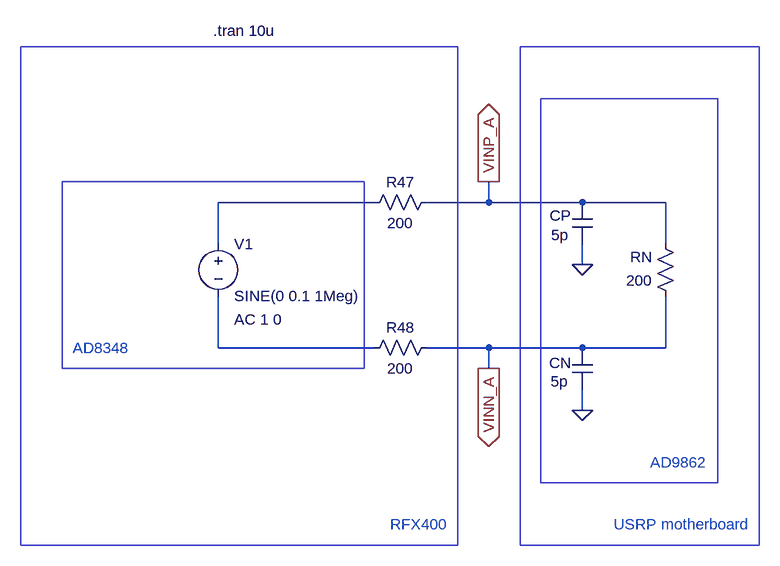
[diagram p0: schematic RFX400-AD8348-OUT.asc]
RFX400-AD8348-OUT.asc, the LTspice schematic file:
Version 4
SHEET 1 880 680
WIRE 272 48 32 48
WIRE 448 48 448 16
WIRE 448 48 352 48
WIRE 592 48 448 48
WIRE 720 48 592 48
WIRE 32 112 32 48
WIRE 720 112 720 48
WIRE 592 144 592 112
WIRE 32 272 32 192
WIRE 272 272 32 272
WIRE 448 272 352 272
WIRE 592 272 448 272
WIRE 720 272 720 192
WIRE 720 272 592 272
WIRE 448 304 448 272
WIRE 592 368 592 336
FLAG 448 304 VINN_A
IOPIN 448 304 Out
FLAG 448 16 VINP_A
IOPIN 448 16 Out
FLAG 592 144 0
FLAG 592 368 0
SYMBOL res 368 32 R90
WINDOW 0 0 56 VBottom 0
WINDOW 3 32 56 VTop 0
SYMATTR InstName R47
SYMATTR Value 200
SYMATTR SpiceLine tol=1 pwr=0.1
SYMBOL res 368 256 R90
WINDOW 0 0 56 VBottom 0
WINDOW 3 32 56 VTop 0
SYMATTR InstName R48
SYMATTR Value 200
SYMATTR SpiceLine tol=1 pwr=0.1
SYMBOL cap 576 48 R0
WINDOW 0 -34 20 Left 0
WINDOW 3 -32 50 Left 0
SYMATTR InstName CP
SYMATTR Value 5p
SYMBOL res 736 208 R180
WINDOW 0 36 76 Left 0
WINDOW 3 36 40 Left 0
SYMATTR InstName RN
SYMATTR Value 200
SYMATTR SpiceLine tol=1 pwr=0.1
SYMBOL cap 576 272 R0
WINDOW 0 -35 23 Left 0
WINDOW 3 -33 52 Left 0
SYMATTR InstName CN
SYMATTR Value 5p
SYMBOL voltage 32 96 R0
WINDOW 123 24 132 Left 0
WINDOW 39 24 132 Left 0
SYMATTR Value2 AC 1 0
SYMATTR InstName V1
SYMATTR Value SINE(0 0.1 1Meg)
TEXT 24 -216 Left 0 !.tran 10u
TEXT 696 448 Left 0 ;AD9862
TEXT -192 272 Left 0 ;AD8348
TEXT 296 544 Left 0 ;RFX400
TEXT 640 544 Left 0 ;USRP motherboard
RECTANGLE Normal 528 480 800 -112
RECTANGLE Normal -208 304 256 16
RECTANGLE Normal 496 576 864 -192
RECTANGLE Normal -272 576 400 -192

The netlist it stands for:
* RFX400-AD8348-OUT.asc
R47 VINP_A N001 200 tol=1 pwr=0.1
R48 VINN_A N002 200 tol=1 pwr=0.1
CP VINP_A 0 5p
RN VINN_A VINP_A 200 tol=1 pwr=0.1
CN VINN_A 0 5p
V1 N001 N002 SINE(0 0.1 1Meg) AC 1 0
.tran 10u
* AD9862
* AD8348
* RFX400
* USRP motherboard
.backanno
.end